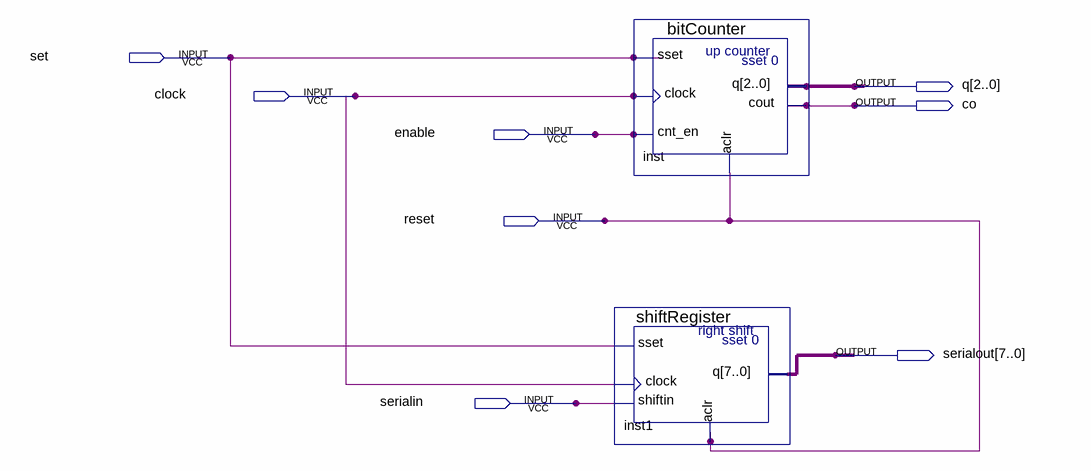
[diagram p0: schematic sheet]
// Quartus schematic counterReg.bdf as structural Verilog: 2 symbols, 8 pins
module counterReg (
  input  set,
  input  clock,
  input  enable,
  input  reset,
  input  serialin,
  output [2:0] q,
  output co,
  output [7:0] serialout
);

  bitCounter inst (.sset(set), .clock(clock), .cnt_en(enable), .aclr(reset), .cout(co), .q(q));
  shiftRegister inst1 (.sset(set), .clock(clock), .shiftin(serialin), .aclr(reset), .q(serialout));
endmodule
